# Altium schematic sheet modulo_temperaturaUmidade.SchDoc
size A4; SheetNumber: 1; SheetTotal: 1
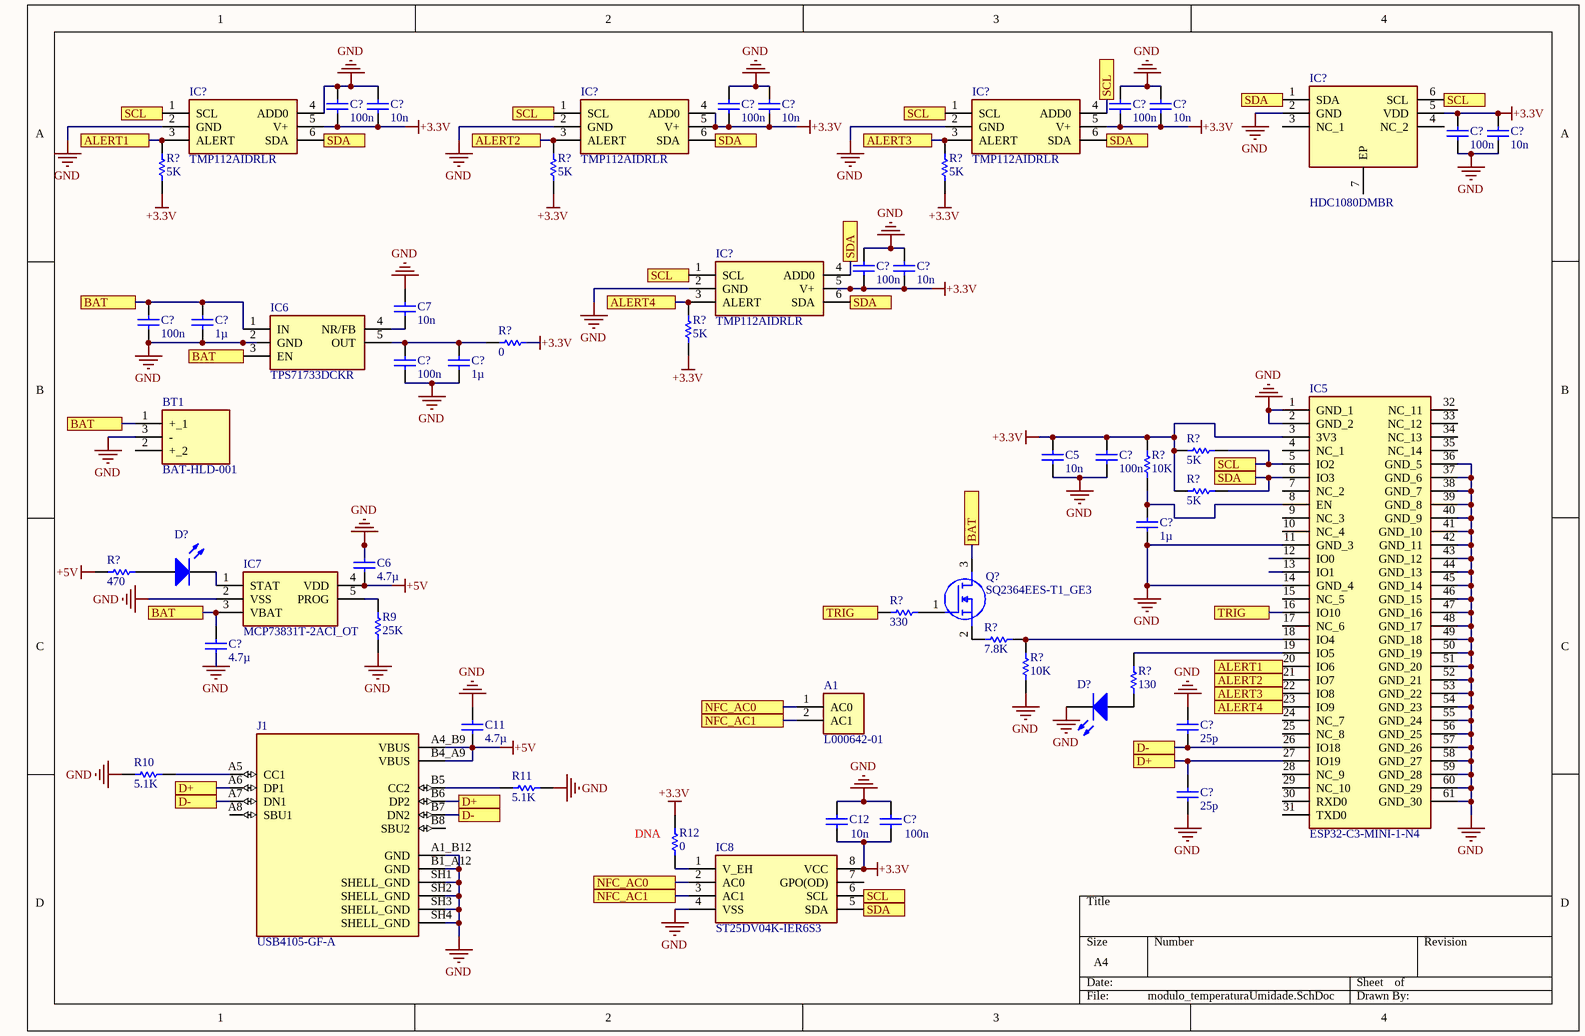
[diagram p0: modulo_temperaturaUmidade.SchDoc]

## Parts
(Parts that share a designator on the sheet are numbered #1, #2 ... from top to bottom, then left to right.)
A1  L000642-01
BT1  BAT-HLD-001  [BATHLD001]
C5  value 10n  (hidden comment: Capacitor)
C6  value 4.7µ  (hidden comment: Capacitor)
C7  value 10n  (hidden comment: Capacitor)
C11  value 4.7µ  (hidden comment: Capacitor)
C12  value 10n  (hidden comment: Capacitor)
C?#1  value 100n  (hidden comment: Capacitor)
C?#2  value 10n  (hidden comment: Capacitor)
C?#3  value 100n  (hidden comment: Capacitor)
C?#4  value 10n  (hidden comment: Capacitor)
C?#5  value 100n  (hidden comment: Capacitor)
C?#6  value 10n  (hidden comment: Capacitor)
C?#7  value 100n  (hidden comment: Capacitor)
C?#8  value 10n  (hidden comment: Capacitor)
C?#9  value 100n  (hidden comment: Capacitor)
C?#10  value 10n  (hidden comment: Capacitor)
C?#11  value 100n  (hidden comment: Capacitor)
C?#12  value 1µ  (hidden comment: Capacitor)
C?#13  value 100n  (hidden comment: Capacitor)
C?#14  value 1µ  (hidden comment: Capacitor)
C?#15  value 100n  (hidden comment: Capacitor)
C?#16  value 1µ  (hidden comment: Capacitor)
C?#17  value 4.7µ  (hidden comment: Capacitor)
C?#18  value 25p  (hidden comment: Capacitor)
C?#19  value 25p  (hidden comment: Capacitor)
C?#20  value 100n  (hidden comment: Capacitor)
D?#1  Light-Emitting Diode  (value not drawn)
D?#2  Light-Emitting Diode  (value not drawn)
IC5  ESP32-C3-MINI-1-N4  [ESP32C3MINI1N4]
IC6  TPS71733DCKR  [SOT65P210X110-5N]
IC7  MCP73831T-2ACI_OT  [SOT95P270X145-5N]
IC8  ST25DV04K-IER6S3  [SOIC127P600X175-8N]
IC?#1  HDC1080DMBR  [SON100P300X300X80-7N-D]
IC?#2  TMP112AIDRLR  [SOTFL50P160X60-6N]
IC?#3  TMP112AIDRLR  [SOTFL50P160X60-6N]
IC?#4  TMP112AIDRLR  [SOTFL50P160X60-6N]
IC?#5  TMP112AIDRLR  [SOTFL50P160X60-6N]
J1  USB4105-GF-A  [GCT_USB4105-GF-A]
Q?  SQ2364EES-T1_GE3  [SOT95P237X112-3N]
R9  value 25K  (hidden comment: Resistor)
R10  value 5.1K  (hidden comment: Resistor)
R11  value 5.1K  (hidden comment: Resistor)
R12  value 0  (hidden comment: Resistor)
R?#1  value 5K  (hidden comment: Resistor)
R?#2  value 5K  (hidden comment: Resistor)
R?#3  value 5K  (hidden comment: Resistor)
R?#4  value 0  (hidden comment: Resistor)
R?#5  value 5K  (hidden comment: Resistor)
R?#6  value 5K  (hidden comment: Resistor)
R?#7  value 10K  (hidden comment: Resistor)
R?#8  value 5K  (hidden comment: Resistor)
R?#9  value 470  (hidden comment: Resistor)
R?#10  value 330  (hidden comment: Resistor)
R?#11  value 7.8K  (hidden comment: Resistor)
R?#12  value 10K  (hidden comment: Resistor)
R?#13  value 130  (hidden comment: Resistor)

## Ports
ALERT1, ALERT2, ALERT3, ALERT4, BAT, D+, D-, NFC_AC0, NFC_AC1, SCL, SDA, TRIG

## Nets
   +5V: C6.1 C11.2 IC7.4(VDD) J1.A4_B9(VBUS) J1.B4_A9(VBUS) R?#9.2  [also labelled +5V]
+3.3V: C5.2 C12.1 C?#1.1 C?#2.1 C?#3.1 C?#4.1 C?#5.1 C?#6.1 C?#7.2 C?#8.2 C?#9.1 C?#10.1 C?#15.2 C?#20.1 IC5.3(3V3) IC8.8(VCC) IC?#1.5(VDD) IC?#2.5(V+) IC?#3.4(ADD0) IC?#3.5(V+) IC?#4.5(V+) IC?#5.5(V+) R12.1 R?#1.1 R?#2.1 R?#3.1 R?#4.2 R?#5.1 R?#6.2 R?#7.2 R?#8.2
GND: BT1.3(-) C5.1 C6.2 C7.2 C11.1 C12.2 C?#1.2 C?#2.2 C?#3.2 C?#4.2 C?#5.2 C?#6.2 C?#7.1 C?#8.1 C?#9.2 C?#10.2 C?#11.1 C?#12.1 C?#13.1 C?#14.1 C?#15.1 C?#16.1 C?#17.1 C?#18.2 C?#19.1 C?#20.2 D?#2.2(K) IC5.1(GND_1) IC5.2(GND_2) IC5.11(GND_3) IC5.14(GND_4) IC5.36(GND_5) IC5.37(GND_6) IC5.38(GND_7) IC5.39(GND_8) IC5.40(GND_9) IC5.41(GND_10) IC5.42(GND_11) IC5.43(GND_12) IC5.44(GND_13) IC5.45(GND_14) IC5.46(GND_15) IC5.47(GND_16) IC5.48(GND_17) IC5.49(GND_18) IC5.50(GND_19) IC5.51(GND_20) IC5.52(GND_21) IC5.53(GND_22) IC5.54(GND_23) IC5.55(GND_24) IC5.56(GND_25) IC5.57(GND_26) IC5.58(GND_27) IC5.59(GND_28) IC5.60(GND_29) IC5.61(GND_30) IC6.2(GND) IC7.2(VSS) IC8.4(VSS) IC?#1.2(GND) IC?#2.2(GND) IC?#2.4(ADD0) IC?#3.2(GND) IC?#4.2(GND) IC?#5.2(GND) J1.A1_B12(GND) J1.B1_A12(GND) J1.SH1(SHELL_GND) J1.SH2(SHELL_GND) J1.SH3(SHELL_GND) J1.SH4(SHELL_GND) R9.1 R10.1 R11.1 R?#12.2
ALERT1: IC5.20(IO6) IC?#2.3(ALERT) R?#1.2 ; port ALERT1
ALERT2: IC5.21(IO7) IC?#3.3(ALERT) R?#2.2 ; port ALERT2
ALERT3: IC5.22(IO8) IC?#4.3(ALERT) R?#3.2 ; port ALERT3
ALERT4: IC5.23(IO9) IC?#5.3(ALERT) R?#5.2 ; port ALERT4
BAT: BT1.1(+_1) C?#11.2 C?#12.2 C?#17.2 IC6.1(IN) IC6.3(EN) IC7.3(VBAT) Q?.3(D) ; port BAT
D+: C?#19.2 IC5.27(IO19) J1.A6(DP1) J1.B6(DP2) ; port D+
D-: C?#18.1 IC5.26(IO18) J1.A7(DN1) J1.B7(DN2) ; port D-
NFC_AC0: A1.1(AC0) IC8.2(AC0) ; port NFC_AC0
NFC_AC1: A1.2(AC1) IC8.3(AC1) ; port NFC_AC1
SCL: IC5.5(IO2) IC8.6(SCL) IC?#1.6(SCL) IC?#2.1(SCL) IC?#3.1(SCL) IC?#4.1(SCL) IC?#4.4(ADD0) IC?#5.1(SCL) R?#6.1 ; port SCL
SDA: IC5.6(IO3) IC8.5(SDA) IC?#1.1(SDA) IC?#2.6(SDA) IC?#3.6(SDA) IC?#4.6(SDA) IC?#5.4(ADD0) IC?#5.6(SDA) R?#8.1 ; port SDA
TRIG: IC5.16(IO10) R?#10.2 ; port TRIG
NetC7_1: C7.1 IC6.4(NR/FB)
NetC?#13_2: C?#13.2 C?#14.2 IC6.5(OUT) R?#4.1
NetC?#16_2: C?#16.2 IC5.8(EN) R?#7.1
NetD?#1_1: D?#1.1(A) R?#9.1
NetD?#1_2: D?#1.2(K) IC7.1(STAT)
NetD?#2_1: D?#2.1(A) R?#13.1
NetIC5_18: IC5.18(IO4) R?#11.2 R?#12.1
NetIC5_19: IC5.19(IO5) R?#13.2
NetIC7_5: IC7.5(PROG) R9.2
NetIC8_1: IC8.1(V_EH) R12.2
NetJ1_A5: J1.A5(CC1) R10.2
NetJ1_B5: J1.B5(CC2) R11.2
NetQ?_1: Q?.1(G) R?#10.1
NetQ?_2: Q?.2(S) R?#11.1

Not connected (* = marked no-connect by the designer): BT1 2(+_2); IC5 4(NC_1) 7(NC_2) 9(NC_3) 10(NC_4) 12(IO0) 13(IO1) 15(NC_5) 17(NC_6) 24(NC_7) 25(NC_8) 28(NC_9) 29(NC_10) 30(RXD0) 31(TXD0) 32(NC_11) 33(NC_12) 34(NC_13) 35(NC_14); IC8 7(GPO(OD)); IC?#1 3(NC_1) 4(NC_2) 7(EP); J1 A8(SBU1) B8(SBU2)

## Notes on the sheet
- (near R12) DNA

## Library data of the parts
A1 = L000642-01: Antena NFC 13.56MHz
BT1 = BAT-HLD-001: Battery; Manufacturer_Name: TE Connectivity; Datasheet Link: https://www.te.com/commerce/DocumentDelivery/DDEController?Action=showdoc&DocId=Customer+Drawing%7FC-BAT-HLD-001-xx%7FE%7Fpdf%7FEnglish%7FENG_CD_C-BAT-HLD-001-xx_E.pdf%7FBAT-HLD-001; Height: 4.3mm; Manufacturer_Part_Number: BAT-HLD-001; Mouser Part Number: 712-BAT-HLD-001; Mouser Price/Stock: https://www.mouser.co.uk/ProductDetail/TE-Connectivity-Linx-Technologies/BAT-HLD-001?qs=K5ta8V%252BWhta7hbVGfm4dqA%3D%3D; Arrow Part Number: BAT-HLD-001; Arrow Price/Stock: https://www.arrow.com/en/products/bat-hld-001/te-connectivity?region=nac
C5-C7 C11 C12 C?#1-C?#17 C?#20 = Capacitor: Capacitor / Cerâmico de baixa ESR / X7R ou X5R; SimulationGenericComponent: True
C?#18 C?#19 = Capacitor: Capacitor / Cerâmico / C0G (NP0); SimulationGenericComponent: True
D?#1 = LED: Light-Emitting Diode / Amarelo; AF: 1; BV: 0; BV_MAX: 1e99; EG: 1.11; FC: 0.5; IBV: 0.001; IS: 1e-14; MJSW: 0.33; NTUN: 30; TNOM: 27; XTI: 3; SimulationGenericComponent: True; CJO: 0; CJP: 0; CTA: 0; CTP: 0; FCS: 0.5; FV_MAX: 1e99; IKF: 0; IKR: 0; ISR: 1e-14; JSW: 0; JTUN: 0; JTUNSW: 0; KEG: 1; KF: 0; LEVEL: 1; N: 1; NBV: 1; NR: 1; NS: 1; PHP: 1; RS: 0; TCV: 0; TLEV: 0; TLEVC: 0; TM1: 0; TM2: 0; TPB: 0; TPHP: 0; TRS: 0; TRS2: 0; TT: 0; TTT1: 0; TTT2: 0; VJ: 1; XTITUN: 3
D?#2 = LED: Light-Emitting Diode / Vermelho; AF: 1; BV: 0; BV_MAX: 1e99; EG: 1.11; FC: 0.5; IBV: 0.001; IS: 1e-14; MJSW: 0.33; NTUN: 30; TNOM: 27; XTI: 3; SimulationGenericComponent: True; CJO: 0; CJP: 0; CTA: 0; CTP: 0; FCS: 0.5; FV_MAX: 1e99; IKF: 0; IKR: 0; ISR: 1e-14; JSW: 0; JTUN: 0; JTUNSW: 0; KEG: 1; KF: 0; LEVEL: 1; N: 1; NBV: 1; NR: 1; NS: 1; PHP: 1; RS: 0; TCV: 0; TLEV: 0; TLEVC: 0; TM1: 0; TM2: 0; TPB: 0; TPHP: 0; TRS: 0; TRS2: 0; TT: 0; TTT1: 0; TTT2: 0; VJ: 1; XTITUN: 3
IC5 = ESP32-C3-MINI-1-N4: Integrated Circuit; Manufacturer_Name: Espressif Systems; Datasheet Link: https://www.mouser.com/datasheet/2/891/Espressif_ESP32_C3_MINI_1_Datasheet-2006822.pdf; Height: 2.55mm; Manufacturer_Part_Number: ESP32-C3-MINI-1-N4; Mouser Part Number: 356-ESP32-C3-MINI1N4; Mouser Price/Stock: https://www.mouser.co.uk/ProductDetail/Espressif-Systems/ESP32-C3-MINI-1-N4?qs=stqOd1AaK7%252B%2FpH3qqyGehA%3D%3D
IC6 = TPS71733DCKR: Integrated Circuit; Manufacturer_Name: Texas Instruments; Datasheet Link: http://www.ti.com/lit/gpn/tps717; Height: 1.1mm; Manufacturer_Part_Number: TPS71733DCKR; Mouser Part Number: 595-TPS71733DCKR; Mouser Price/Stock: https://www.mouser.co.uk/ProductDetail/Texas-Instruments/TPS71733DCKR?qs=QZuYiDxzHaicbGKtUrLzCQ%3D%3D; Arrow Part Number: TPS71733DCKR; Arrow Price/Stock: https://www.arrow.com/en/products/tps71733dckr/texas-instruments?region=nac
IC7 = MCP73831T-2ACI_OT: Integrated Circuit; Manufacturer_Name: Microchip; Manufacturer_Part_Number: MCP73831T-2ACI/OT; Datasheet Link: http://ww1.microchip.com/downloads/en/DeviceDoc/20001984g.pdf; Height: 1.45mm; Mouser Part Number: 579-MCP73831T-2ACIOT; Mouser Price/Stock: https://www.mouser.co.uk/ProductDetail/Microchip-Technology/MCP73831T-2ACI-OT?qs=yUQqVecv4qvbBQBGbHx0Mw%3D%3D; Arrow Part Number: MCP73831T-2ACI/OT; Arrow Price/Stock: https://www.arrow.com/en/products/mcp73831t-2aciot/microchip-technology?utm_currency=USD&region=nac
IC8 = ST25DV04K-IER6S3: Integrated Circuit; Manufacturer_Name: STMicroelectronics; Datasheet Link: https://ms.componentsearchengine.com/Datasheets/2/ST25DV04K-IER6S3.pdf; Height: 1.75mm; Manufacturer_Part_Number: ST25DV04K-IER6S3; Mouser Part Number: 511-ST25DV04K-IER6S3; Mouser Price/Stock: https://www.mouser.co.uk/ProductDetail/STMicroelectronics/ST25DV04K-IER6S3?qs=xjeEZJU9OeNdtP1j9447OQ%3D%3D; Arrow Part Number: ST25DV04K-IER6S3; Arrow Price/Stock: https://www.arrow.com/en/products/st25dv04k-ier6s3/stmicroelectronics?utm_currency=USD&region=europe
IC?#1 = HDC1080DMBR: Integrated Circuit; Manufacturer_Name: Texas Instruments; Datasheet Link: http://www.ti.com/lit/gpn/HDC1080; Height: 0.8mm; Manufacturer_Part_Number: HDC1080DMBR; Mouser Part Number: 595-HDC1080DMBR; Mouser Price/Stock: https://www.mouser.co.uk/ProductDetail/Texas-Instruments/HDC1080DMBR?qs=8%2FmU9qzJpL9OuhPLRSO9Vg%3D%3D; Arrow Part Number: HDC1080DMBR; Arrow Price/Stock: https://www.arrow.com/en/products/hdc1080dmbr/texas-instruments?region=nac
IC?#2-IC?#5 = TMP112AIDRLR: Integrated Circuit; Manufacturer_Name: Texas Instruments; Datasheet Link: http://www.ti.com/general/docs/suppproductinfo.tsp?distId=10&gotoUrl=http%3A%2F%2Fwww.ti.com%2Flit%2Fgpn%2Ftmp112; Height: 0.6mm; Manufacturer_Part_Number: TMP112AIDRLR; Mouser Part Number: 595-TMP112AIDRLR; Mouser Price/Stock: https://www.mouser.co.uk/ProductDetail/Texas-Instruments/TMP112AIDRLR?qs=62Z1lCHpKYghtK4%2FJn2ysA%3D%3D; Arrow Part Number: TMP112AIDRLR; Arrow Price/Stock: https://www.arrow.com/en/products/tmp112aidrlr/texas-instruments?region=nac
J1 = USB4105-GF-A: MF: {'manufacturer': u'GCT'}; Package: None; Price: None; Value: *; MP: USB4105-GF-A; Availability: Unavailable
Q? = SQ2364EES-T1_GE3: MOSFET (N-Channel); Manufacturer_Name: Vishay; Datasheet Link: http://www.vishay.com/ppg?75975&quality; Height: 1.12mm; Manufacturer_Part_Number: SQ2364EES-T1_GE3; Mouser Part Number: 78-SQ2364EES-T1_GE3; Mouser Price/Stock: https://www.mouser.co.uk/ProductDetail/Vishay-Semiconductors/SQ2364EES-T1_GE3?qs=lYGu3FyN48cd%2FdtaQTPJxw%3D%3D; Arrow Part Number: SQ2364EES-T1_GE3; Arrow Price/Stock: https://www.arrow.com/en/products/sq2364ees-t1-ge3/vishay?utm_currency=USD&region=nac
R9-R11 R?#1-R?#3 R?#5-R?#13 = Resistor: TC1: 0; SimulationGenericComponent: True; TC2: 0
R12 R?#4 = Resistor: SimulationGenericComponent: True; TC1: 0; TC2: 0